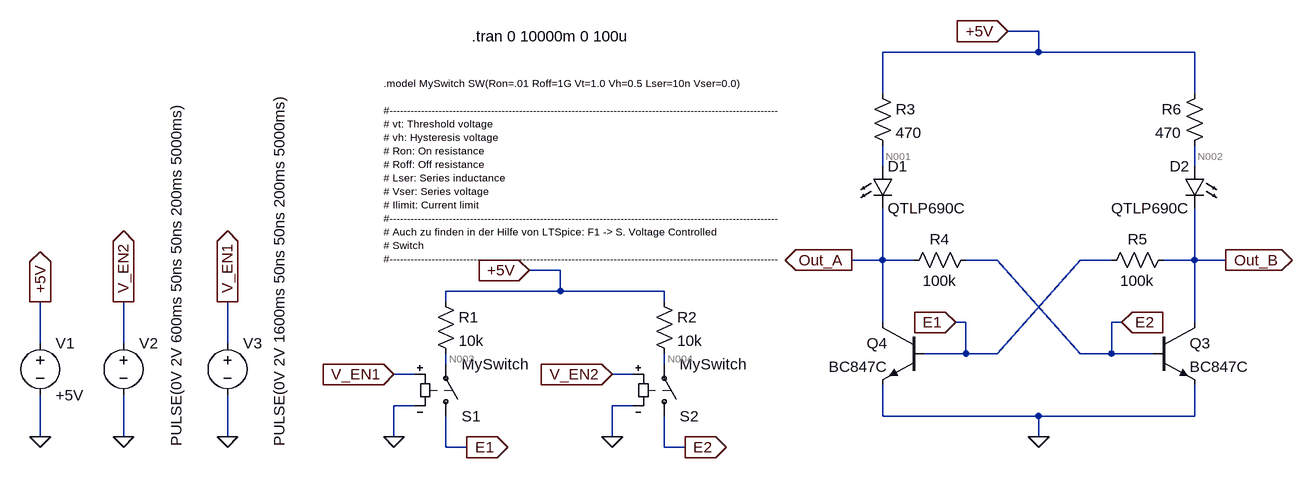
[diagram p0: schematic Projekt_6_Bistabile_Kippstufe_aka_Flip_Flop_1.asc]
Projekt_6_Bistabile_Kippstufe_aka_Flip_Flop_1.asc, the LTspice schematic file:
Version 4
SHEET 1 2712 680
WIRE 720 -512 672 -512
WIRE 720 -480 720 -512
WIRE 720 -480 480 -480
WIRE 960 -480 720 -480
WIRE 480 -416 480 -480
WIRE 960 -416 960 -480
WIRE 480 -304 480 -336
WIRE 960 -304 960 -336
WIRE 480 -160 480 -240
WIRE 480 -160 432 -160
WIRE 528 -160 480 -160
WIRE 656 -160 608 -160
WIRE 832 -160 784 -160
WIRE 960 -160 960 -240
WIRE 960 -160 912 -160
WIRE 1008 -160 960 -160
WIRE -16 -144 -64 -144
WIRE -16 -112 -16 -144
WIRE -16 -112 -192 -112
WIRE 144 -112 -16 -112
WIRE -192 -96 -192 -112
WIRE 144 -96 144 -112
WIRE 480 -64 480 -160
WIRE 608 -64 592 -64
WIRE 848 -64 832 -64
WIRE 960 -64 960 -160
WIRE -816 -32 -816 -96
WIRE -688 -32 -688 -96
WIRE -528 -32 -528 -96
WIRE 608 -16 608 -64
WIRE 608 -16 544 -16
WIRE 656 -16 784 -160
WIRE 656 -16 608 -16
WIRE 784 -16 656 -160
WIRE 832 -16 832 -64
WIRE 832 -16 784 -16
WIRE 896 -16 832 -16
WIRE -192 0 -192 -16
WIRE 144 0 144 -16
WIRE -240 16 -272 16
WIRE 96 16 64 16
WIRE -240 64 -272 64
WIRE 96 64 64 64
WIRE 480 80 480 32
WIRE 720 80 480 80
WIRE 960 80 960 32
WIRE 960 80 720 80
WIRE -816 112 -816 48
WIRE -688 112 -688 48
WIRE -528 112 -528 48
WIRE -272 112 -272 64
WIRE 64 112 64 64
WIRE 720 112 720 80
WIRE -192 128 -192 80
WIRE -160 128 -192 128
WIRE 144 128 144 80
WIRE 176 128 144 128
FLAG -816 112 0
FLAG -816 -96 +5V
IOPIN -816 -96 Out
FLAG -64 -144 +5V
IOPIN -64 -144 In
FLAG 720 112 0
FLAG 432 -160 Out_A
IOPIN 432 -160 Out
FLAG 1008 -160 Out_B
IOPIN 1008 -160 Out
FLAG -688 -96 V_EN2
IOPIN -688 -96 Out
FLAG -688 112 0
FLAG -272 16 V_EN1
IOPIN -272 16 In
FLAG -272 112 0
FLAG 64 16 V_EN2
IOPIN 64 16 In
FLAG 64 112 0
FLAG -160 128 E1
IOPIN -160 128 Out
FLAG 176 128 E2
IOPIN 176 128 Out
FLAG 592 -64 E1
IOPIN 592 -64 In
FLAG 848 -64 E2
IOPIN 848 -64 In
FLAG -528 -96 V_EN1
IOPIN -528 -96 Out
FLAG -528 112 0
FLAG 672 -512 +5V
IOPIN 672 -512 In
SYMBOL voltage -816 -48 R0
WINDOW 123 0 0 Left 2
WINDOW 39 0 0 Left 2
SYMATTR InstName V1
SYMATTR Value +5V
SYMBOL npn 896 -64 R0
SYMATTR InstName Q3
SYMATTR Value BC847C
SYMBOL npn 544 -64 M0
SYMATTR InstName Q4
SYMATTR Value BC847C
SYMBOL res 976 -432 M0
SYMATTR InstName R6
SYMATTR Value 470
SYMBOL sw -192 96 M180
SYMATTR InstName S1
SYMATTR Value MySwitch
SYMBOL voltage -688 -48 R0
WINDOW 3 81 175 VLeft 2
WINDOW 123 0 0 Left 2
WINDOW 39 0 0 Left 2
SYMATTR Value PULSE(0V 2V 600ms 50ns 50ns 200ms 5000ms)
SYMATTR InstName V2
SYMBOL res -208 -112 R0
SYMATTR InstName R1
SYMATTR Value 10k
SYMBOL res 128 -112 R0
SYMATTR InstName R2
SYMATTR Value 10k
SYMBOL res 464 -432 R0
SYMATTR InstName R3
SYMATTR Value 470
SYMBOL LED 464 -304 R0
SYMATTR InstName D1
SYMATTR Value QTLP690C
SYMBOL sw 144 96 M180
SYMATTR InstName S2
SYMATTR Value MySwitch
SYMBOL res 512 -144 R270
WINDOW 0 32 56 VTop 2
WINDOW 3 0 56 VBottom 2
SYMATTR InstName R4
SYMATTR Value 100k
SYMBOL voltage -528 -48 R0
WINDOW 3 80 175 VLeft 2
WINDOW 123 0 0 Left 2
WINDOW 39 0 0 Left 2
SYMATTR Value PULSE(0V 2V 1600ms 50ns 50ns 200ms 5000ms)
SYMATTR InstName V3
SYMBOL res 928 -176 R90
WINDOW 0 0 56 VBottom 2
WINDOW 3 32 56 VTop 2
SYMATTR InstName R5
SYMATTR Value 100k
SYMBOL LED 976 -304 M0
SYMATTR InstName D2
SYMATTR Value QTLP690C
TEXT -152 -504 Left 2 !.tran 0 10000m 0 100u
TEXT -288 -432 Left 1 !.model MySwitch SW(Ron=.01 Roff=1G Vt=1.0 Vh=0.5 Lser=10n Vser=0.0)\n \n#---------------------------------------------------------------------------------------------------------------\n# vt: Threshold voltage\n# vh: Hysteresis voltage\n# Ron: On resistance\n# Roff: Off resistance\n# Lser: Series inductance\n# Vser: Series voltage\n# Ilimit: Current limit\n#---------------------------------------------------------------------------------------------------------------\n# Auch zu finden in der Hilfe von LTSpice: F1 -> S. Voltage Controlled\n# Switch\n#---------------------------------------------------------------------------------------------------------------

The netlist it stands for:
* Projekt_6_Bistabile_Kippstufe_aka_Flip_Flop_1.asc
V1 +5V 0 +5V
Q3 Out_B E2 0 0 BC847C
Q4 Out_A E1 0 0 BC847C
R6 +5V N002 470
S1 E1 N003 V_EN1 0 MySwitch
V2 V_EN2 0 PULSE(0V 2V 600ms 50ns 50ns 200ms 5000ms)
R1 +5V N003 10k
R2 +5V N004 10k
R3 +5V N001 470
D1 N001 Out_A QTLP690C
S2 E2 N004 V_EN2 0 MySwitch
R4 Out_A E2 100k
V3 V_EN1 0 PULSE(0V 2V 1600ms 50ns 50ns 200ms 5000ms)
R5 Out_B E1 100k
D2 N002 Out_B QTLP690C
.model D D
.lib standard.dio
.model NPN NPN
.model PNP PNP
.lib standard.bjt
.tran 0 10000m 0 100u
.model MySwitch SW(Ron=.01 Roff=1G Vt=1.0 Vh=0.5 Lser=10n Vser=0.0)
#---------------------------------------------------------------------------------------------------------------
# vt: Threshold voltage
# vh: Hysteresis voltage
# Ron: On resistance
# Roff: Off resistance
# Lser: Series inductance
# Vser: Series voltage
# Ilimit: Current limit
#---------------------------------------------------------------------------------------------------------------
# Auch zu finden in der Hilfe von LTSpice: F1 -> S. Voltage Controlled
# Switch
#---------------------------------------------------------------------------------------------------------------
.backanno
.end

* Results of the author's LTspice run, read from the files saved beside the schematic
* Operating Point, zero values left out:
*   V(+5v) = 5 V
*   V(out_b) = 1.454 V
*   V(e2) = 666.3 mV
*   V(out_a) = 1.454 V
*   V(e1) = 666.3 mV
*   V(n002) = 3.225 V
*   V(n003) = 5 V
*   V(n004) = 5 V
*   V(n001) = 3.225 V
*   Ic(Q4) = 3.768 mA
*   Ib(Q4) = 7.878 µA
*   Ie(Q4) = -3.776 mA
*   Ic(Q3) = 3.768 mA
*   Ib(Q3) = 7.878 µA
*   Ie(Q3) = -3.776 mA
*   I(D2) = 3.776 mA
*   I(D1) = 3.776 mA
*   I(R5) = 7.874 µA
*   I(R4) = 7.874 µA
*   I(R3) = 3.776 mA
*   I(R2) = 4.338 nA
*   I(R1) = 4.338 nA
*   I(R6) = 3.776 mA
*   I(S2) = 4.338 nA
*   I(S1) = 4.338 nA
*   I(V1) = -7.552 mA
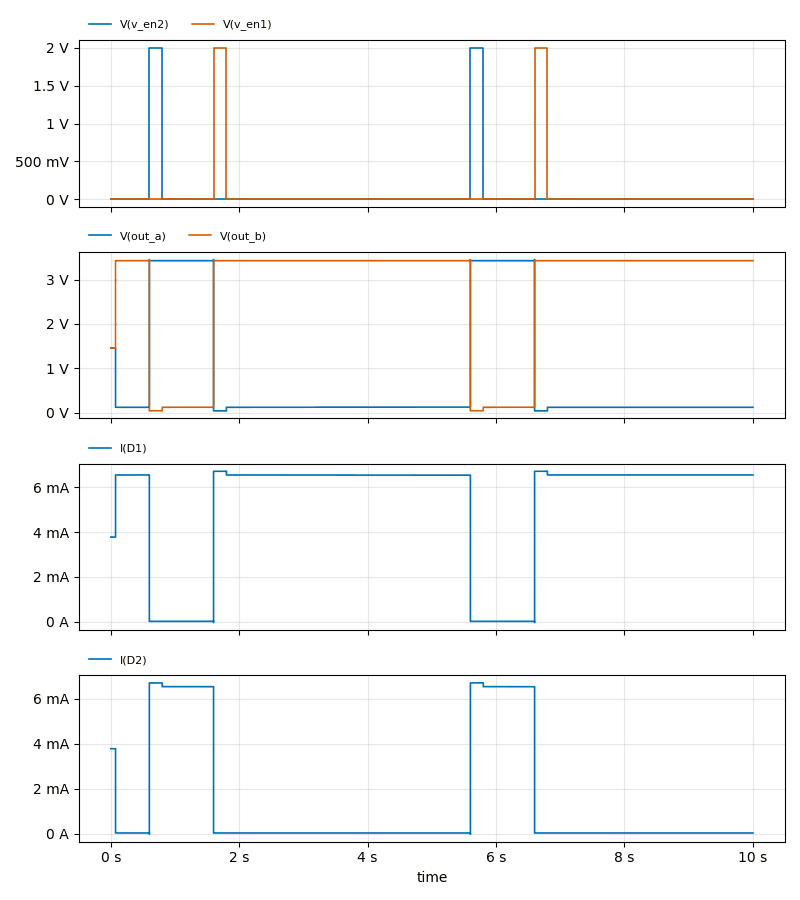
[diagram p1: Transient Analysis of Projekt_6_Bistabile_Kippstufe_aka_Flip_Flop_1.asc, plotted from the saved traces]
* Transient Analysis, 1 run:
*   V(v_en2): min 0 V, max 2 V, average 80 mV, rms 400 mV, last 0 V
*   V(v_en1): min 0 V, max 2 V, average 80 mV, rms 400 mV, last 0 V
*   V(out_a): min 37.02 mV, max 3.455 V, average 786.6 mV, rms 1.542 V, last 117.7 mV
*   V(out_b): min 37.02 mV, max 3.455 V, average 2.749 V, rms 3.056 V, last 3.429 V
*   I(D1): min -24.31 µA, max 6.705 mA, average 5.222 mA, rms 5.837 mA, last 6.538 mA
*   I(D2): min -24.31 µA, max 6.705 mA, average 1.364 mA, rms 2.957 mA, last 27.45 µA